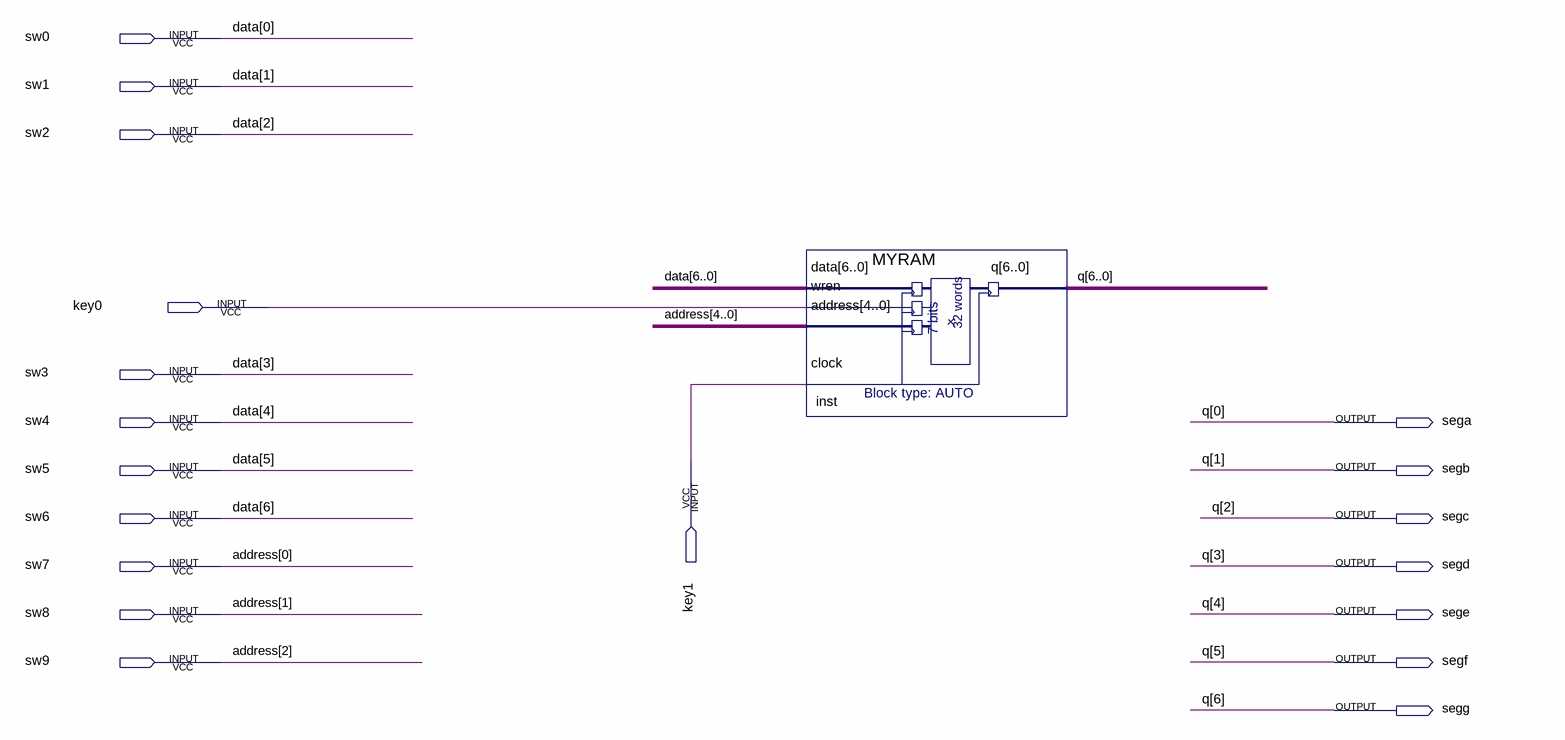
[diagram p0: schematic sheet]
// Quartus schematic RAM.bdf as structural Verilog: 1 symbols, 19 pins
module RAM (
  input  sw0,
  input  sw1,
  input  sw2,
  input  key0,
  input  sw3,
  input  sw4,
  input  key1,
  input  sw5,
  input  sw6,
  input  sw7,
  input  sw8,
  input  sw9,
  output sega,
  output segb,
  output segc,
  output segd,
  output sege,
  output segf,
  output segg
);

  wire [4:3] address;

  MYRAM inst (
    .data({sw6, sw5, sw4, sw3, sw2, sw1, sw0}), .wren(key0), .address({address, sw9, sw8, sw7}),
    .clock(key1), .q({segg, segf, sege, segd, segc, segb, sega}));

  // Other names for the same wires on the sheet: address[2:0] = {sw9, sw8, sw7};
  //   data[6:0] = {sw6, sw5, sw4, sw3, sw2, sw1, sw0}; q[6:0] = {segg, segf, sege, segd, segc, segb, sega}
endmodule
